# EAGLE design StepperDriverBoard (EAGLE 9.7.0)
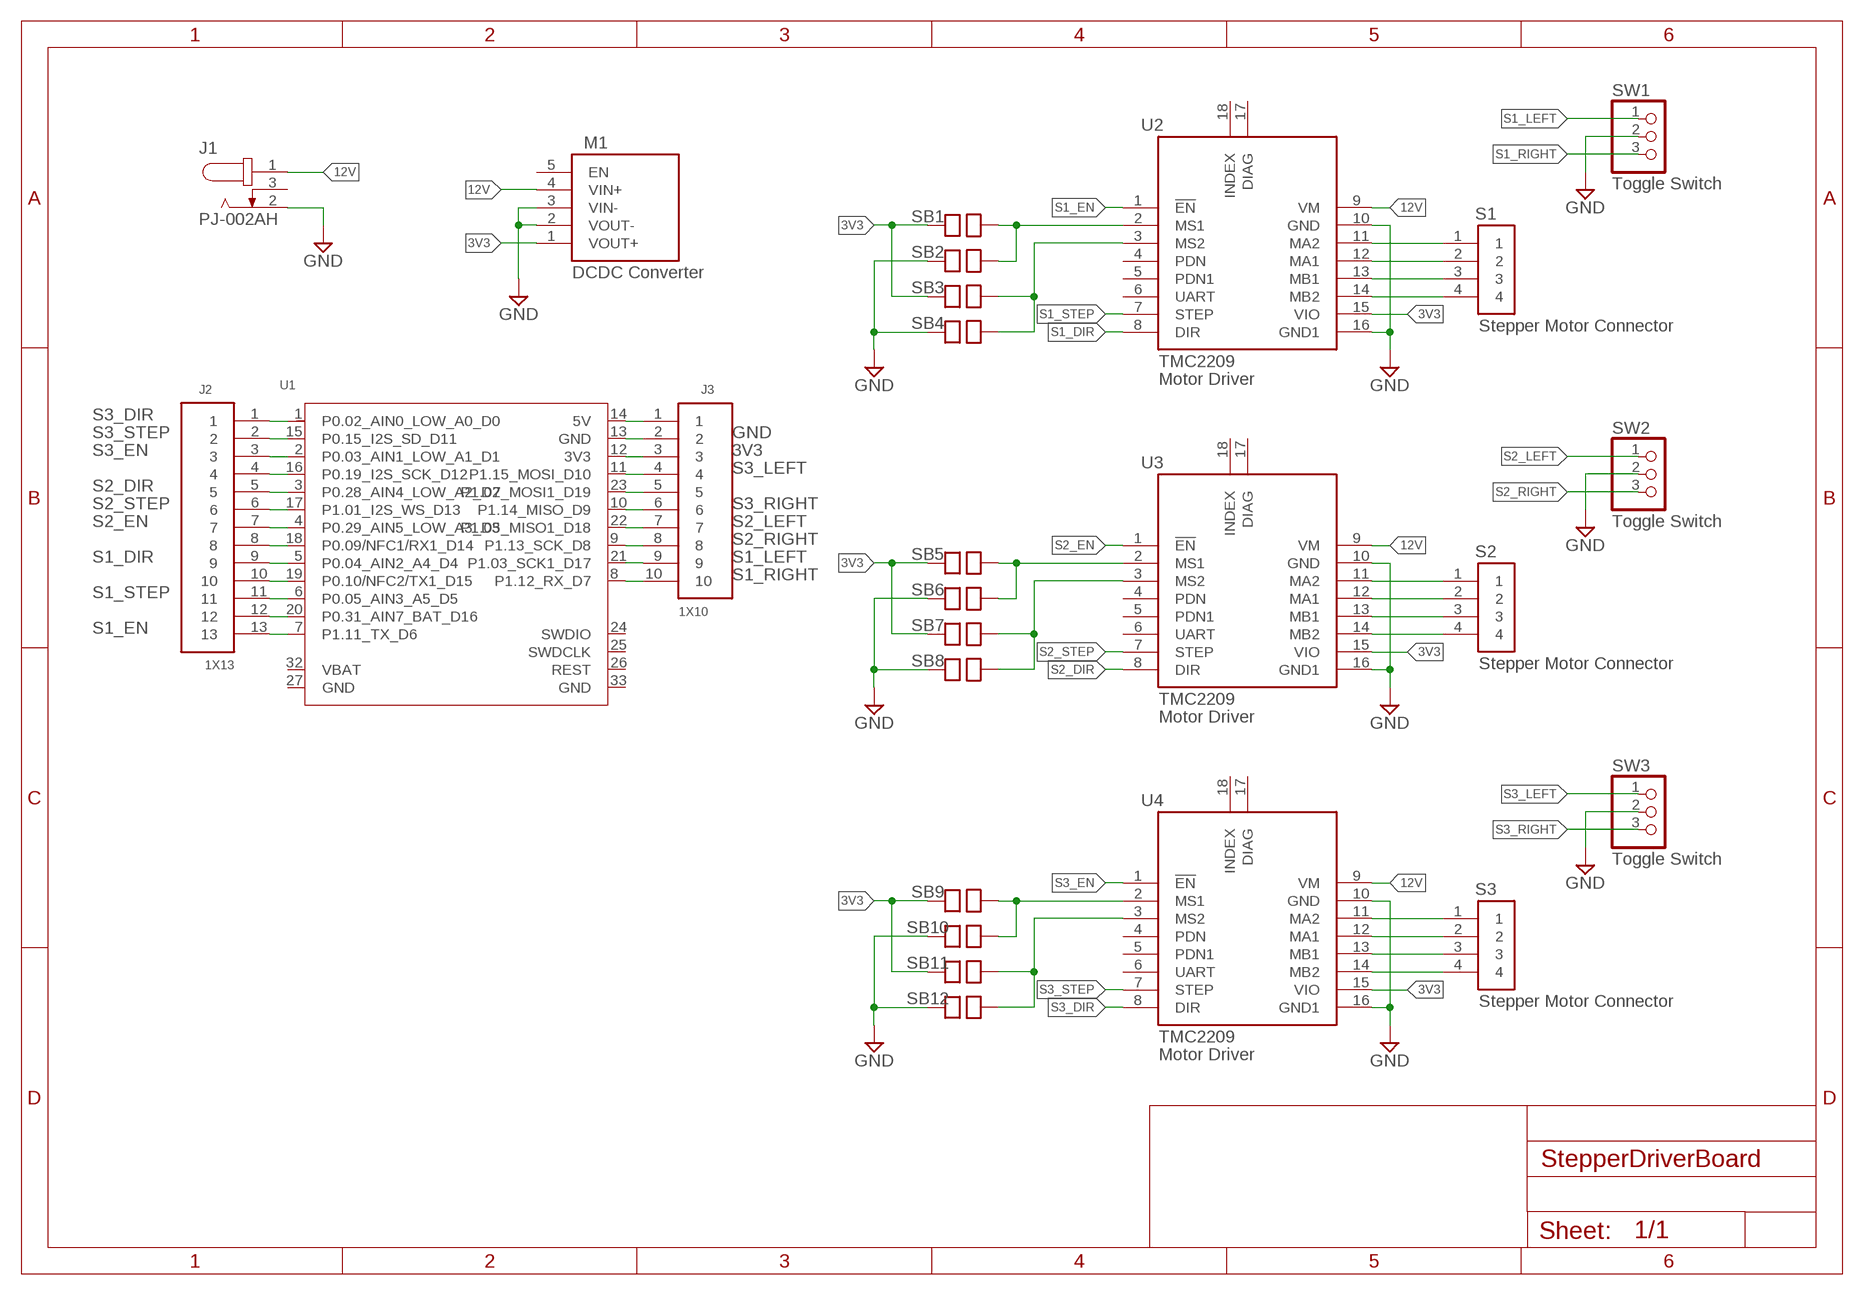
[diagram p0: schematic, sheet 1]

## Parts
J1  PJ-002AH  [CUI_PJ-002AH]
J2  1X13  [1X13-127MM]
J3  1X10  [1X10-127MM]
M1  DCDC Converter  DROK_5V  [DROK_5V]
S1  Stepper Motor Connector  1X4-BIG  [1X04-BIG]
S2  Stepper Motor Connector  1X4-BIG  [1X04-BIG]
S3  Stepper Motor Connector  1X4-BIG  [1X04-BIG]
SB1  JUMPERP  [JUMPER]
SB2  JUMPERP  [JUMPER]
SB3  JUMPERP  [JUMPER]
SB4  JUMPERP  [JUMPER]
SB5  JUMPERP  [JUMPER]
SB6  JUMPERP  [JUMPER]
SB7  JUMPERP  [JUMPER]
SB8  JUMPERP  [JUMPER]
SB9  JUMPERP  [JUMPER]
SB10  JUMPERP  [JUMPER]
SB11  JUMPERP  [JUMPER]
SB12  JUMPERP  [JUMPER]
SW1  Toggle Switch  PINHD-1X3  [1X03]
SW2  Toggle Switch  PINHD-1X3  [1X03]
SW3  Toggle Switch  PINHD-1X3  [1X03]
U1  XIAO-NRF52840_PLUS_SMDXIAO-NRF52840_PLUS  [XIAO-NRF52840_PLUS_SMD]
U2  TMC2209  TMC2209_PINS  [MODULE_TMC2209_PINS]
U3  TMC2209  TMC2209_PINS  [MODULE_TMC2209_PINS]
U4  TMC2209  TMC2209_PINS  [MODULE_TMC2209_PINS]

## Nets
3V3: J3.3 M1.1(VOUT+) SB1.1 SB3.1 SB5.1 SB7.1 SB9.1 SB11.1 U1.12(3V3) U2.15(VIO) U3.15(VIO) U4.15(VIO)
12V: J1.1 M1.4(VIN+) U2.9(VM) U3.9(VM) U4.9(VM)
GND: J1.2 J3.2 M1.2(VOUT-) M1.3(VIN-) SB2.1 SB4.1 SB6.1 SB8.1 SB10.1 SB12.1 SW1.2 SW2.2 SW3.2 U1.13(GND) U2.10(GND) U2.16(GND1) U3.10(GND) U3.16(GND1) U4.10(GND) U4.16(GND1)
N$1: S2.1 U3.11(MA2)
N$2: S1.1 U2.11(MA2)
N$3: S1.2 U2.12(MA1)
N$4: S1.3 U2.13(MB1)
N$5: S1.4 U2.14(MB2)
N$6: SB1.2 SB2.2 U2.2(MS1)
N$7: SB3.2 SB4.2 U2.3(MS2)
N$8: S2.2 U3.12(MA1)
N$9: S2.3 U3.13(MB1)
N$10: S2.4 U3.14(MB2)
N$11: SB5.2 SB6.2 U3.2(MS1)
N$12: SB7.2 SB8.2 U3.3(MS2)
N$13: S3.1 U4.11(MA2)
N$14: S3.2 U4.12(MA1)
N$15: S3.3 U4.13(MB1)
N$16: S3.4 U4.14(MB2)
N$17: SB9.2 SB10.2 U4.2(MS1)
N$18: SB11.2 SB12.2 U4.3(MS2)
N$19: J2.10 U1.19(P0.10/NFC2/TX1_D15)
N$20: J2.8 U1.18(P0.09/NFC1/RX1_D14)
N$21: J2.12 U1.20(P0.31_AIN7_BAT_D16)
N$24: J2.4 U1.16(P0.19_I2S_SCK_D12)
N$32: J3.1 U1.14(5V)
N$36: J3.5 U1.23(P1.07_MOSI1_D19)
S1_DIR: J2.9 U1.5(P0.04_AIN2_A4_D4) U2.8(DIR)
S1_EN: J2.13 U1.7(P1.11_TX_D6) U2.1(!EN)
S1_LEFT: J3.9 SW1.1 U1.21(P1.03_SCK1_D17)
S1_RIGHT: J3.10 SW1.3 U1.8(P1.12_RX_D7)
S1_STEP: J2.11 U1.6(P0.05_AIN3_A5_D5) U2.7(STEP)
S2_DIR: J2.5 U1.3(P0.28_AIN4_LOW_A2_D2) U3.8(DIR)
S2_EN: J2.7 U1.4(P0.29_AIN5_LOW_A3_D3) U3.1(!EN)
S2_LEFT: J3.7 SW2.1 U1.22(P1.05_MISO1_D18)
S2_RIGHT: J3.8 SW2.3 U1.9(P1.13_SCK_D8)
S2_STEP: J2.6 U1.17(P1.01_I2S_WS_D13) U3.7(STEP)
S3_DIR: J2.1 U1.1(P0.02_AIN0_LOW_A0_D0) U4.8(DIR)
S3_EN: J2.3 U1.2(P0.03_AIN1_LOW_A1_D1) U4.1(!EN)
S3_LEFT: J3.4 SW3.1 U1.11(P1.15_MOSI_D10)
S3_RIGHT: J3.6 SW3.3 U1.10(P1.14_MISO_D9)
S3_STEP: J2.2 U1.15(P0.15_I2S_SD_D11) U4.7(STEP)
Unconnected: J1.3 M1.5(EN) U1.24(SWDIO) U1.25(SWDCLK) U1.26(REST) U1.27(GND) U1.32(VBAT) U1.33(GND) U2.4(PDN) U2.5(PDN1) U2.6(UART) U2.17(DIAG) U2.18(INDEX) U3.4(PDN) U3.5(PDN1) U3.6(UART) U3.17(DIAG) U3.18(INDEX) U4.4(PDN) U4.5(PDN1) U4.6(UART) U4.17(DIAG) U4.18(INDEX)

## Notes on the sheet
- Motor Driver
- Motor Driver
- Motor Driver

## Library data of the parts
J1 = PENNEDS:PJ-002AH; CHECK_PRICES: https://www.snapeda.com/parts/PJ-002AH/Same+Sky/view-part/?ref=eda; DESCRIPTION: 2.0 x 6.5 mm, 5.0 A, Horizontal, Through Hole, Dc Power Jack Connector; DIGIKEY_PART_NUMBER: CP-002AH-ND; MF: Same Sky; MP: PJ-002AH; PACKAGE: None; SNAPEDA_LINK: https://www.snapeda.com/parts/PJ-002AH/Same+Sky/view-part/?ref=snap
J2 = PENNEDS:1X13
J3 = PENNEDS:1X10
M1 = PENNEDS:DROK_5V
S1-S3 = PENNEDS:1X4: 4-pin connector
SB1-SB12 = PENNEDS:JUMPER: Resistor Fixed - Generic
SW1-SW3 = PENNEDS:PINHD-1X3: PIN HEADER; CATEGORY: Headers; DESCRIPTION: Header, Straight, 3 Position; MANUFACTURER: Generic; MPN: Generic; OPERATING_TEMPERATURE: Generic; PART_STATUS: Active; PITCH: 0.100" (2.54mm); ROHS_COMPLIANCE: Generic; SERIES: Generic; SUB-CATEGORY: Headers, Male Pins; TYPE: Board to Board or Cable, Unshrouded, Through Hole, Straight
U1 = PENNEDS:XIAO-NRF52840_PLUS_SMD
U2-U4 = PENNEDS:TMC2209_PINS

## Board
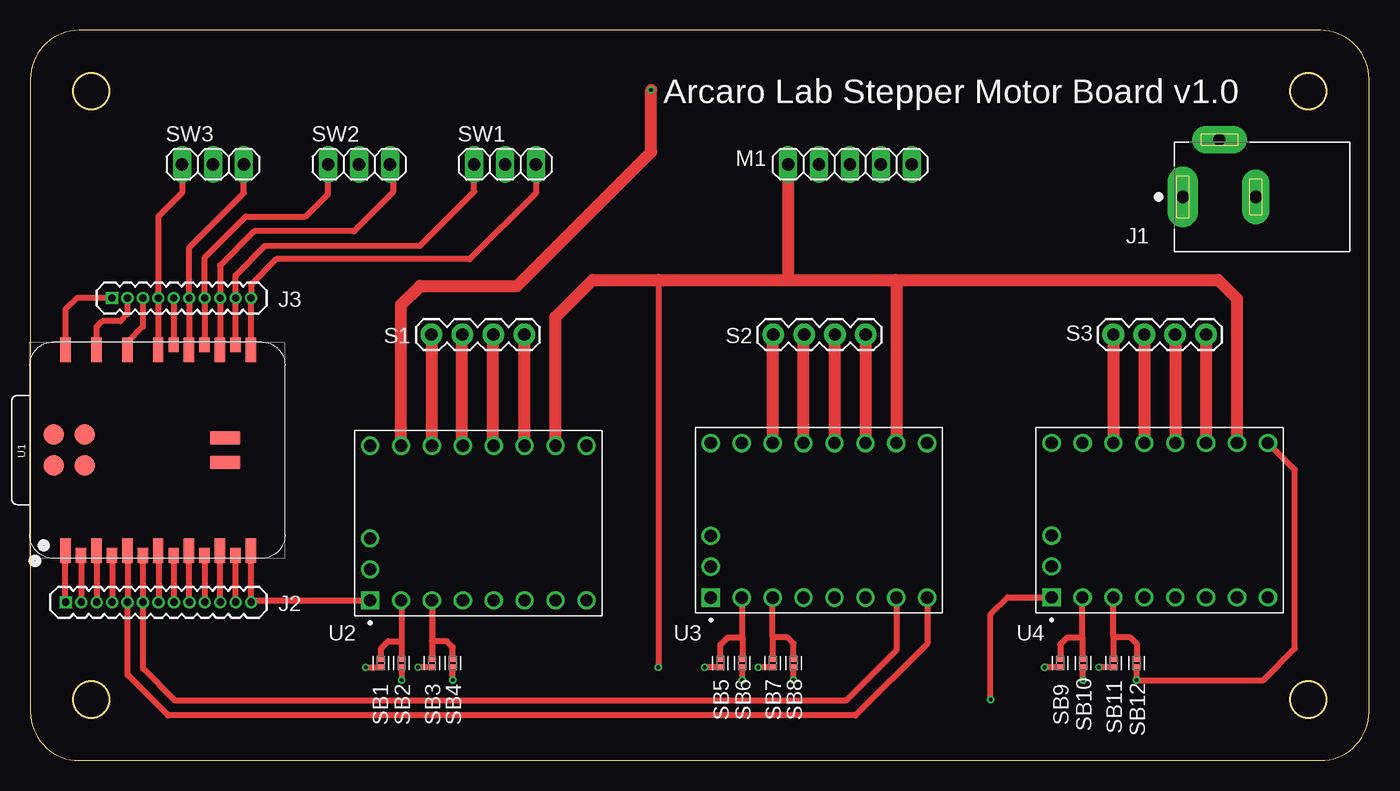
[diagram p1: board, top side]
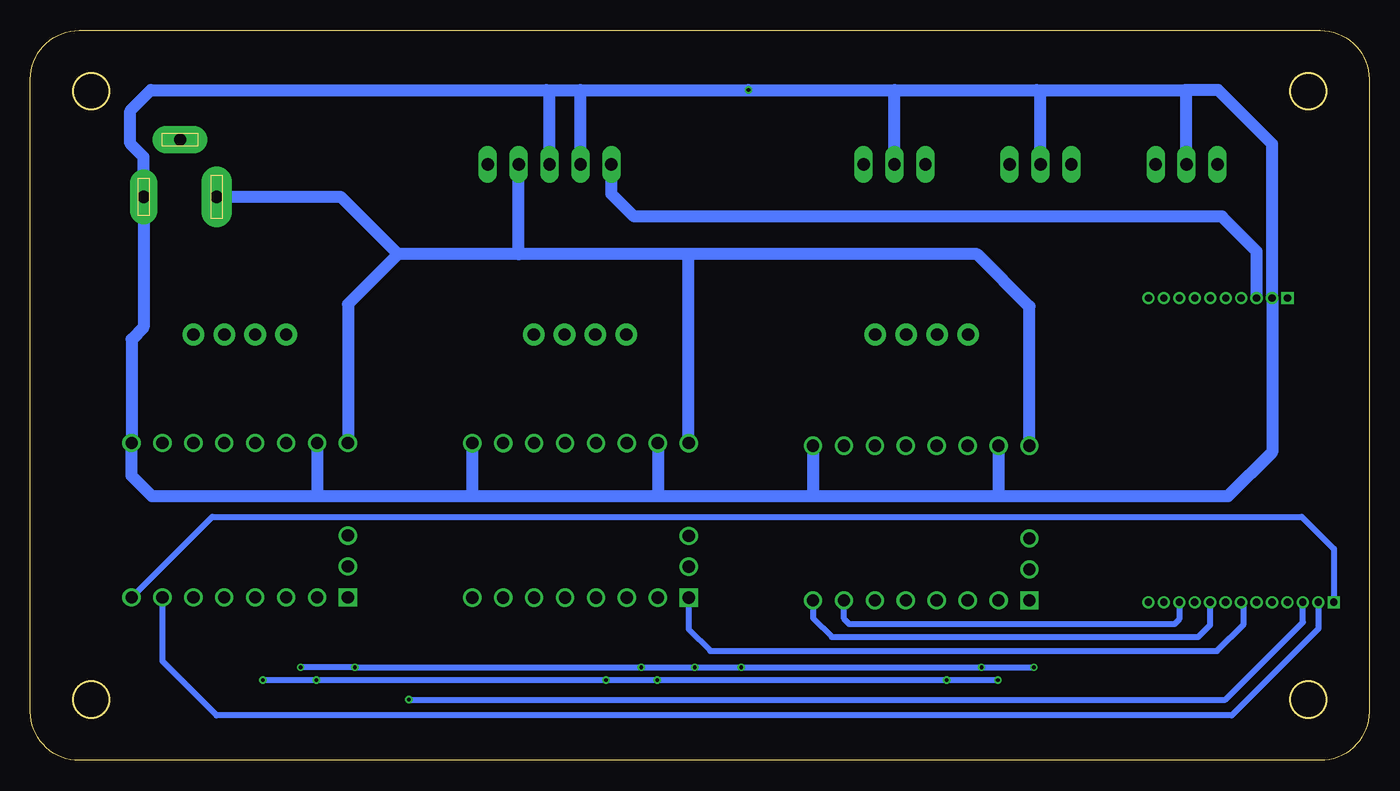
[diagram p2: board, bottom side, seen from below]

Size 110 x 60 mm. Coordinates in mm from the lower left corner, seen from the top.
Outline: 110,56 arc90 106,60 4,60 arc90 0,56 0,4 arc90 4,0 106,0 arc90 110,4 110,56
Outline: circle at 5,55 radius 1.5
Outline: circle at 105,55 radius 1.5
Outline: circle at 5,5 radius 1.5
Outline: circle at 105,5 radius 1.5
Copper layers (1*16): Top 0.035mm / dielectric 1.5mm / Bottom 0.035mm
Design rules "DRC_2L": minimum track width 0.2mm, minimum drill 0.3mm, track to track 0.2mm, track to pad 0.2mm, pad to pad 0.2mm, via to via 0.2mm, smd to smd 0.2mm, copper to edge 1mm, drill to drill 0.2mm, minimum pad ring 0.15mm, minimum via ring 0.15mm, stop-mask expansion 0.1mm, vias tented up to drill 0.33mm, thermal gap 0.25mm

### Footprints (pad centres in the part's own frame; a part is rotated, then mirrored left to right if it is on the bottom)
CUI_PJ-002AH = drill 1 pad 2.5 long: 1 0,0 | drill 1 pad 2.25 long: 2 6,0; 3 3,4.7
1X13-127MM = drill 0.6 pad 1 square: 1 0,0 | drill 0.6 pad 1: 2 1.27,0; 3 2.54,0; 4 3.81,0; 5 5.08,0; 6 6.35,0; 7 7.62,0; 8 8.89,0; 9 10.16,0; 10 11.43,0; 11 12.7,0; 12 13.97,0; 13 15.24,0
1X10-127MM = drill 0.6 pad 1 square: 1 0,0 | drill 0.6 pad 1: 2 1.27,0; 3 2.54,0; 4 3.81,0; 5 5.08,0; 6 6.35,0; 7 7.62,0; 8 8.89,0; 9 10.16,0; 10 11.43,0
DROK_5V = drill 1.016 long: 1 -5.08,0; 2 -2.54,0; 3 0,0; 4 2.54,0; 5 5.08,0
1X04-BIG = drill 1.016 pad 1.778: 1 0,0; 2 2.54,0; 3 5.08,0; 4 7.62,0
JUMPER = smd 0.5 x 0.6: 1 -0.35,0; 2 0.35,0
1X03 = drill 1.016 long: 1 -2.54,0; 2 0,0; 3 2.54,0
XIAO-NRF52840_PLUS_SMD = smd 0.95 x 2.032: 1 7.62,8.255; 2 5.08,8.255; 3 2.54,8.255; 4 0,8.255; 5 -2.54,8.255; 6 -5.08,8.255; 7 -7.62,8.255; 8 -7.62,-8.255; 9 -5.08,-8.255; 10 -2.54,-8.255; 11 0,-8.255; 12 2.54,-8.255; 13 5.08,-8.255; 14 7.62,-8.255 | smd 0.95 x 1.232: 15 6.35,8.655; 16 3.81,8.655; 17 1.27,8.655; 18 -1.27,8.655; 19 -3.81,8.655; 20 -6.35,8.655; 21 -6.35,-8.655; 22 -3.81,-8.655; 23 -1.27,-8.655 | smd 1.7 x 1.7: 24 8.572,1.27; 25 8.572,-1.27; 26 6.032,1.27; 27 6.032,-1.27 | smd 2.5 x 1.1: 32 -5.518,0.994; 33 -5.518,-1.006
MODULE_TMC2209_PINS = drill 1 square: 1 -6.35,8.89 | drill 1: 2 -6.35,6.35; 3 -6.35,3.81; 4 -6.35,1.27; 5 -6.35,-1.27; 6 -6.35,-3.81; 7 -6.35,-6.35; 8 -6.35,-8.89; 9 6.35,8.89; 10 6.35,6.35; 11 6.35,3.81; 12 6.35,1.27; 13 6.35,-1.27; 14 6.35,-3.81; 15 6.35,-6.35; 16 6.35,-8.89; 17 -1.27,8.89; 18 -3.81,8.89

### Placement (x,y rotation side)
J1  94.7,46.32 0 top
J2  2.9,13 0 top
J3  6.7,38 0 top
M1  67.34,49 0 top
S1  32.95,35 0 top
S2  61.03,35 0 top
S3  88.99,35 0 top
SB1  28.8,8 90 top
SB2  30.5,8 90 top
SB3  33,8 90 top
SB4  34.7,8 90 top
SB5  56.7,8 90 top
SB6  58.5,8 90 top
SB7  60.98,8 90 top
SB8  62.72,8 90 top
SB9  84.62,8 90 top
SB10  86.5,8 90 top
SB11  89,8 90 top
SB12  90.9,8 90 top
SW1  39,49 0 top
SW2  27,49 0 top
SW3  15,49 0 top
U1  10.5,25.5 180 top
U2  36.8,19.51 90 top
U3  64.8,19.73 90 top
U4  92.8,19.75 90 top

### Tracks (layer width: path | path; a pad name or v marks a point on that pad's centre or on a via)
3V3  (via drill 0.3 pad 0.6)
  Top 0.5: J3.3 9.24,35.64 7.96,34.36 U1.12 | SB9.1 v83.35,7.65 | SB11.1 v87.8,7.65 | v27.55,7.65 SB1.1 | SB3.1 v31.85,7.65 | SB5.1 v55.4,7.65 | SB7.1 v59.8,7.65 | 51.6,39.5 v51.6,7.65
  Top 1: M1.1 62.26,39.64 62.4,39.5 | 62.4,39.5 71.1,39.5 | 71.1,39.5 97.6,39.5 99.15,37.95 U4.15 | U3.15 71.15,39.45 71.1,39.5 | U2.15 43.15,36.45 46.2,39.5 51.6,39.5 62.4,39.5
  Bottom 0.5: v87.8,7.65 v83.35,7.65 v59.8,7.65 v55.4,7.65 v51.6,7.65 v31.85,7.65 v27.55,7.65
  Bottom 1: J3.3 9.24,41.84 12.1,44.7 60.4,44.7 62.26,46.56 M1.1
12V
  Bottom 1: U2.9 27.91,37.31 32.2,41.6 55.8,41.6 | 55.8,41.6 69.88,41.6 | 69.88,41.6 M1.4 | 69.88,41.6 79.8,41.6 | 79.8,41.6 83.91,37.49 U4.9 | U3.9 55.91,41.49 55.8,41.6 | J1.1 84.52,46.32 79.8,41.6
GND  (via drill 0.3 pad 0.6)
  Top 0.5: J3.2 7.97,36.67 7.4,36.1 5.9,36.1 5.42,35.62 U1.13 | SB2.1 v30.5,6.6 | v34.7,6.6 SB4.1 | SB12.1 v90.9,6.6 101.3,6.6 103.9,9.2 103.9,23.89 U4.16 | v86.5,6.6 SB10.1 | v62.7,6.6 62.7,7.63 SB8.1 | v58.5,6.6 SB6.1
  Top 1: U2.10 30.45,37.45 32,39 40,39 51,50 v51,55.1
  Bottom 0.5: v30.5,6.6 v34.7,6.6 v58.5,6.6 v62.7,6.6 v86.5,6.6 v90.9,6.6
  Bottom 1: 30.4,21.7 45.7,21.7 | 45.7,21.7 58.6,21.7 | 58.6,21.7 73.8,21.7 | 73.8,21.7 86.7,21.7 | 86.7,21.7 100,21.7 101.69,23.39 U4.16 101.69,34.61 100.7,35.6 J1.2 100.7,49.6 101.8,50.7 101.8,53.4 100.1,55.1 67.6,55.1 | U4.10 86.45,21.95 86.7,21.7 | U3.16 73.69,21.81 73.8,21.7 | U3.10 58.45,21.85 58.6,21.7 | U2.16 45.7,21.7 | 67.6,55.1 64.8,55.1 | 64.8,55.1 v51,55.1 39,55.1 | 39,55.1 27.3,55.1 | 27.3,55.1 15.1,55.1 | SW3.2 15,55 15.1,55.1 | SW2.2 27,54.8 27.3,55.1 | SW1.2 39,55.1 | M1.3 67.34,54.84 67.6,55.1 | M1.2 64.8,55.1 | U2.10 30.45,21.75 30.4,21.7 | 15.1,55.1 12.4,55.1 7.97,50.67 J3.2 7.97,25.33 11.6,21.7 30.4,21.7
N$1
  Top 1: S2.1 61.03,26.12 U3.11
N$2
  Top 1: S1.1 32.99,34.96 U2.11
N$3
  Top 1: S1.2 35.49,25.9 U2.12
N$4
  Top 1: S1.3 38.03,25.9 U2.13
N$5
  Top 1: S1.4 40.61,34.96 U2.14
N$6
  Top 0.5: U2.2 30.5,13.11 30.5,9.8 | 30.5,9.8 SB2.2 | SB1.2 28.8,9.2 29.4,9.8 30.5,9.8
N$7
  Top 0.5: U2.3 33,9.8 | 33,9.8 SB3.2 | SB4.2 34.7,9.3 34.2,9.8 33,9.8
N$8
  Top 1: U3.12 63.53,34.96 S2.2
N$9
  Top 1: S2.3 66.11,26.12 U3.13
N$10
  Top 1: S2.4 68.65,26.12 U3.14
N$11
  Top 0.5: U3.2 58.5,13.33 58.5,10.1 | 58.5,10.1 SB6.2 | SB5.2 56.7,9.5 57.3,10.1 58.5,10.1
N$12
  Top 0.5: 60.99,10.1 U3.3 | 60.99,10.1 SB7.2 | SB8.2 62.72,9.58 62.2,10.1 60.99,10.1
N$13
  Top 1: S3.1 U4.11
N$14
  Top 1: S3.2 U4.12
N$15
  Top 1: S3.3 U4.13
N$16
  Top 1: U4.14 S3.4
N$17
  Top 0.5: 86.45,10.1 U4.2 | 86.45,10.1 86.45,8.4 SB10.2 | SB9.2 84.62,9.52 85.2,10.1 86.45,10.1
N$18
  Top 0.5: 88.99,10.1 U4.3 | 88.99,10.1 SB11.2 | SB12.2 90.9,9.6 90.4,10.1 88.99,10.1
N$19
  Top 0.5: J2.10 14.33,16.82 U1.19
N$20
  Top 0.5: U1.18 11.79,16.82 J2.8
N$21
  Top 0.5: J2.12 16.87,16.82 U1.20
N$24
  Top 0.5: J2.4 6.71,16.82 U1.16
N$32
  Top 0.5: J3.1 3.8,38 2.88,37.08 U1.14
N$36
  Top 0.5: J3.5 U1.23
S1_DIR
  Top 0.5: J2.9 13.06,17.23 U1.5
  Bottom 0.5: U2.8 45.69,11.69 44.15,10.15 14.05,10.15 13.06,11.14 J2.9
S1_EN
  Top 0.5: U1.7 18.14,17.23 J2.13 18.3,13.16 U2.1
S1_LEFT
  Top 0.5: U1.21 J3.9 16.86,39.86 19.3,42.3 32,42.3 36.46,46.76 SW1.1
S1_RIGHT
  Top 0.5: U1.8 J3.10 | J3.10 | SW1.3 41.54,46.64 36.1,41.2 20.2,41.2 18.12,39.12 J3.10
S1_STEP
  Top 0.5: J2.11 15.6,17.23 U1.6
  Bottom 0.5: J2.11 15.6,11.6 16,11.2 42.7,11.2 43.15,11.65 U2.7
S2_DIR
  Top 0.5: U1.3 7.98,17.23 J2.5 7.98,7.02 11.3,3.7 67.8,3.7 73.69,9.59 U3.8
S2_EN
  Top 0.5: U1.4 10.52,17.23 J2.7
  Bottom 0.5: U3.1 55.91,10.78 54.13,9 12.5,9 10.3,11.2 10.3,12.78 J2.7
S2_LEFT
  Top 0.5: U1.22 J3.7 14.32,41.32 17.7,44.7 22.6,44.7 24.46,46.56 SW2.1
S2_RIGHT
  Top 0.5: U1.9 J3.8 15.59,40.69 18.4,43.5 26.6,43.5 29.8,46.7 29.8,48.74 SW2.3
S2_STEP
  Top 0.5: U1.17 9.25,16.82 J2.6 9.25,7.55 11.9,4.9 67,4.9 71.15,9.05 U3.7
S3_DIR
  Top 0.5: J2.1 2.88,13.02 U1.1
  Bottom 0.5: U4.8 95.06,20.03 5.53,20.03 2.9,17.4 J2.1
S3_EN  (via drill 0.3 pad 0.6)
  Top 0.5: J2.3 5.44,17.23 U1.2 | v78.9,5 78.9,12 80.3,13.4 U4.1
  Bottom 0.5: J2.3 5.44,11.36 11.8,5 v78.9,5
S3_LEFT
  Top 0.5: U1.11 J3.4 10.51,44.71 12.46,46.66 SW3.1
S3_RIGHT
  Top 0.5: U1.10 J3.6 13.05,42.15 17.54,46.64 SW3.3
S3_STEP
  Top 0.5: J2.2 4.17,16.82 U1.15
  Bottom 0.5: J2.2 4.17,10.83 11.3,3.7 94.7,3.7 99.15,8.15 U4.7

### Text on the board
tPlace: Arcaro Lab Stepper Motor Board v1.0